# EAGLE design Felfil_PCB_0.9 (EAGLE 7.5.0)
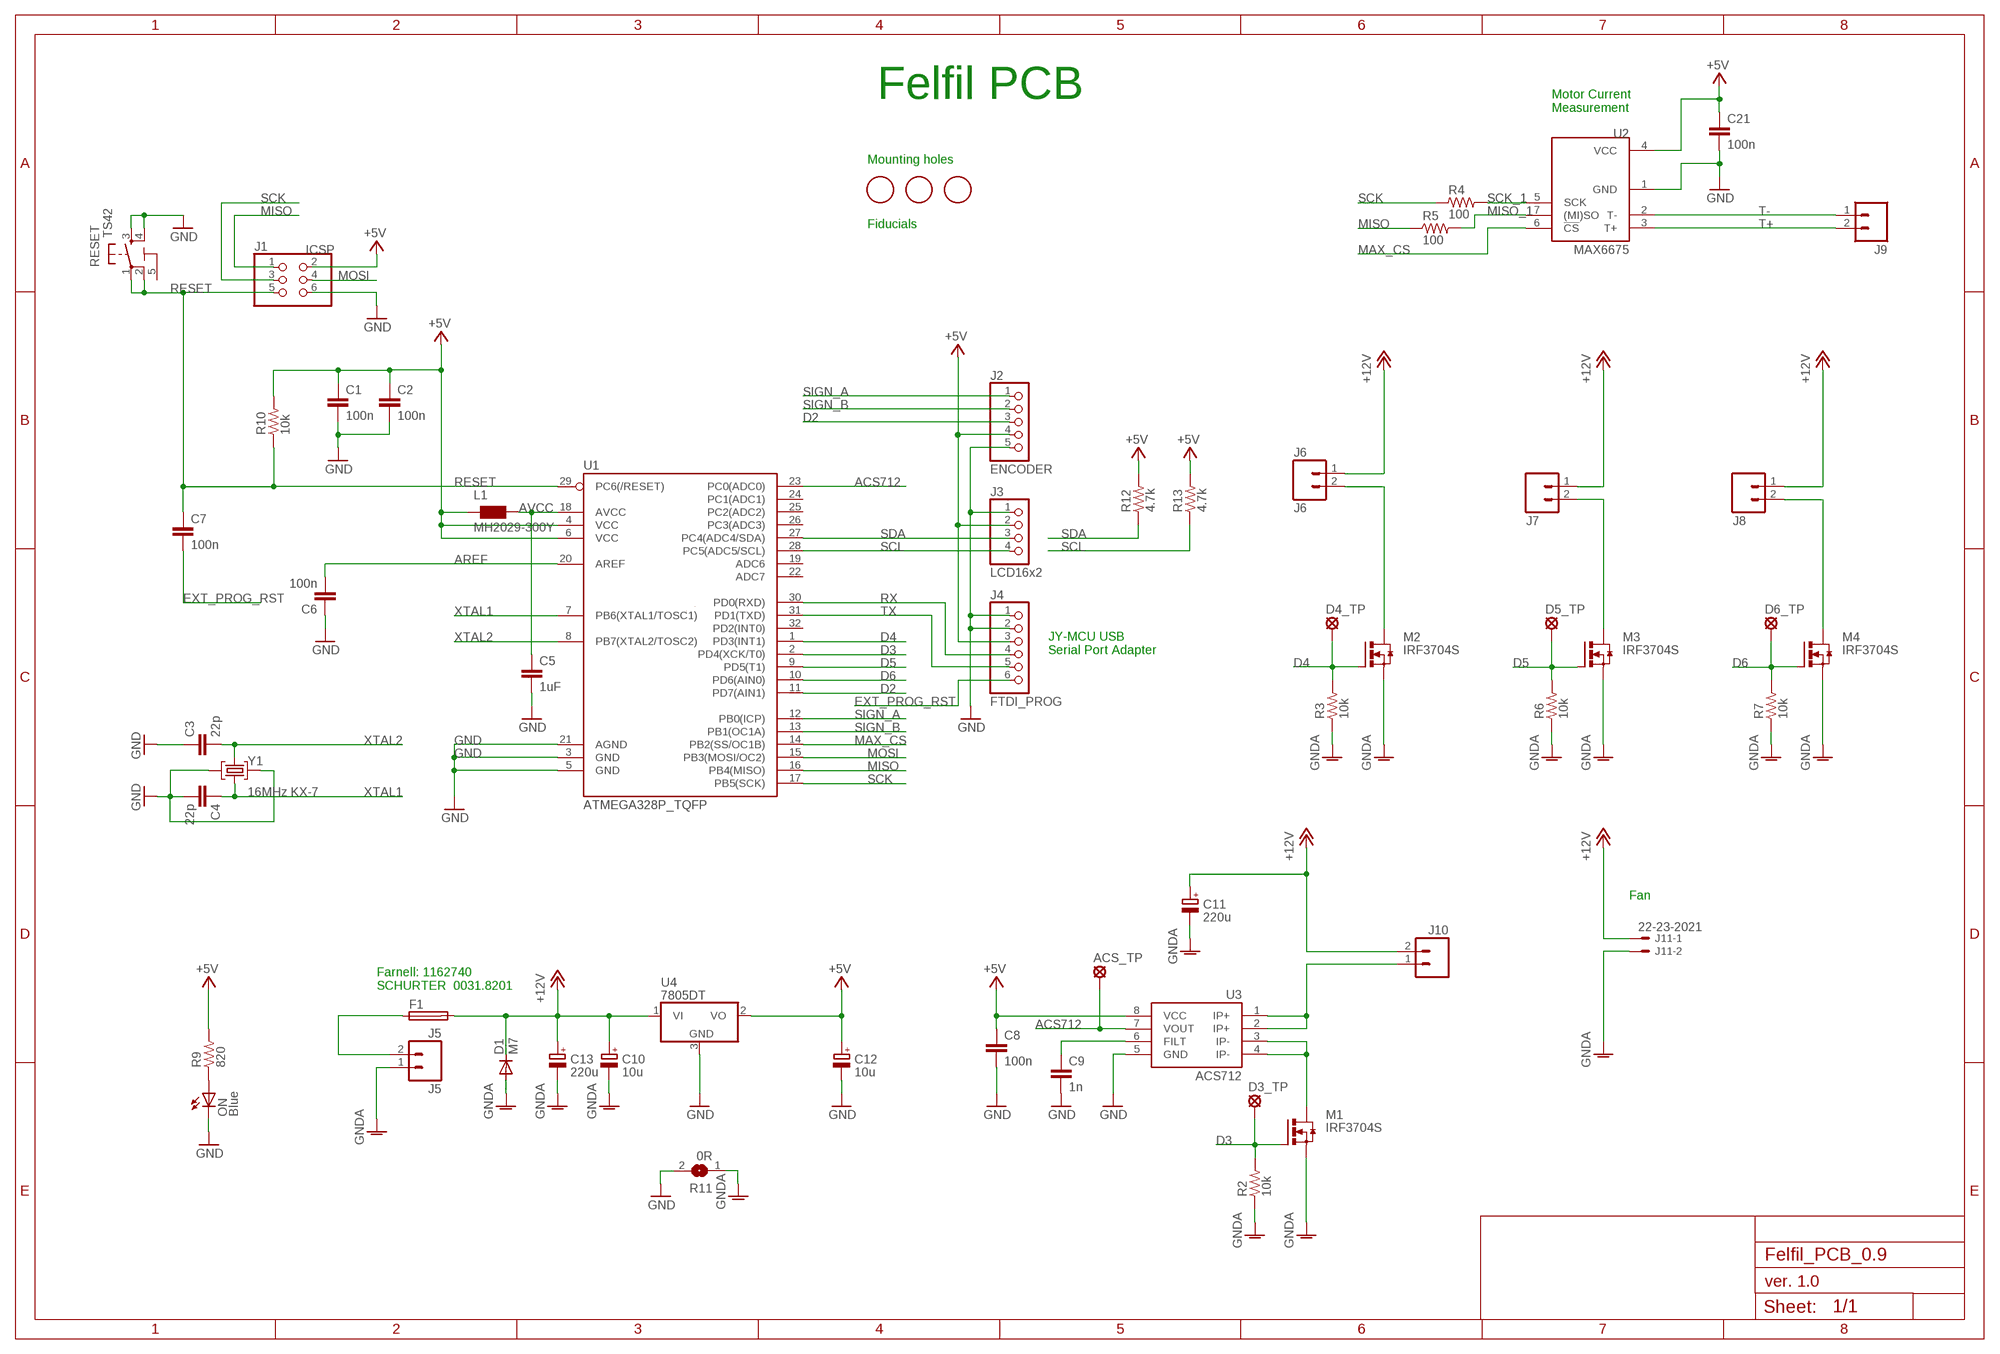
[diagram p0: schematic, sheet 1]

## Parts
ACS_TP  LSP11  [LSP11]
C1  100n  C-EUC0603K  [C0603K]
C2  100n  C-EUC0603K  [C0603K]
C3  22p  C-EUC0603K  [C0603K]
C4  22p  C-EUC0603K  [C0603K]
C5  1uF  C-EUC0603K  [C0603K]
C6  100n  C-EUC0603K  [C0603K]
C7  100n  C-EUC0603K  [C0603K]
C8  100n  C-EUC0603K  [C0603K]
C9  1n  C-EUC0603K  [C0603K]
C10  10u  CPOL-EUSMCB  [SMC_B]
C11  220u  CPOL-EUF  [PANASONIC_F]
C12  10u  CPOL-EUSMCB  [SMC_B]
C13  220u  CPOL-EUF  [PANASONIC_F]
C21  100n  C-EUC0603K  [C0603K]
D1  M7  DIODE-SMB  [SMB]
D3_TP  LSP11  [LSP11]
D4_TP  LSP11  [LSP11]
D5_TP  LSP11  [LSP11]
D6_TP  LSP11  [LSP11]
F1  FUSEBLANK_5X20MM  [FUSE_HOLDER_5X20MM]
FID1  FIDUCIALMOUNT  [FIDUCIA-MOUNT]
FID2  FIDUCIALMOUNT  [FIDUCIA-MOUNT]
FID3  FIDUCIALMOUNT  [FIDUCIA-MOUNT]
J1  ICSP  PINHD-2X3  [2X03]
J2  ENCODER  PINHD-1X5_2.54  [1X05]
J3  LCD16x2  PINHD-1X4_2.54  [1X04]
J4  FTDI_PROG  PINHD-1X6_2.54  [1X06]
J5  J5  M025MM  [SCREWTERMINAL-5MM-2]
J6  J6  M025MM  [SCREWTERMINAL-5MM-2]
J7  M025MM  [SCREWTERMINAL-5MM-2]
J8  M025MM  [SCREWTERMINAL-5MM-2]
J9  M025MM  [SCREWTERMINAL-5MM-2]
J10  M025MM  [SCREWTERMINAL-5MM-2]
J11  22-23-2021  [22-23-2021]
L1  MH2029-300Y  WE-CBF_0805  [0805]
M1  IRF3704S  [D2PACK]
M2  IRF3704S  [D2PACK]
M3  IRF3704S  [D2PACK]
M4  IRF3704S  [D2PACK]
ON  Blue  LEDCHIPLED_0805  [CHIPLED_0805]
R2  10k  R_0603  [R0603]
R3  10k  R_0603  [R0603]
R4  100  R_0603  [R0603]
R5  100  R_0603  [R0603]
R6  10k  R_0603  [R0603]
R7  10k  R_0603  [R0603]
R9  820  R_0603  [R0603]
R10  10k  R_0603  [R0603]
R11  0R  SJW  [SJW]
R12  4.7k  R_0603  [R0603]
R13  4.7k  R_0603  [R0603]
RESET  TS42  [TS42]
U1  ATMEGA328P_TQFP  [TQFP32-08]
U2  MAX6675  [SOIC8]
U3  ACS712  [SO08]
U4  7805DT  [TO252]
Y1  16MHz KX-7  CRYSTAL-3.2-2.5  [CRYSTAL-3.2-2.5]

## Nets
+5V [vcc]: C1.1 C2.1 C8.1 C12.+ C21.1 J1.2 J2.4 J3.2 J4.3 L1.1 R9.2 R10.2 R12.2 R13.2 U1.4(VCC) U1.6(VCC) U2.4(VCC) U3.8(VCC) U4.2(VO)
+12V [vcc]: C10.+ C11.+ C13.+ D1.C F1.2 J6.1 J7.1 J8.1 J10.2 J11.1 U4.1(VI)
ACS712: ACS_TP.MP U1.23(PC0(ADC0)) U3.7(VOUT)
AREF [vcc]: C6.2 U1.20(AREF)
AVCC [vcc]: C5.1 L1.2 U1.18(AVCC)
D2: J2.3 U1.11(PD7(AIN1))
D3: D3_TP.MP M1.1(G) R2.2 U1.2(PD4(XCK/T0))
D4: D4_TP.MP M2.1(G) R3.2 U1.1(PD3(INT1))
D5: D5_TP.MP M3.1(G) R6.2 U1.9(PD5(T1))
D6: D6_TP.MP M4.1(G) R7.2 U1.10(PD6(AIN0))
EXT_PROG_RST: C7.2 J4.6
GND [gnd]: C1.2 C2.2 C3.1 C4.2 C5.2 C6.1 C8.2 C9.2 C12.- C21.2 J1.6 J2.5 J3.1 J4.1 J4.2 ON.C R11.2 RESET.3 RESET.4 U1.3(GND) U1.5(GND) U1.21(AGND) U2.1(GND) U3.5(GND) U4.3(GND) Y1.2(GND) Y1.4(GND)
GNDA [gnd]: C10.- C11.- C13.- D1.A J5.1 J11.2 M1.3(S) M2.3(S) M3.3(S) M4.3(S) R2.1 R3.1 R6.1 R7.1 R11.1
MAX_CS: U1.14(PB2(SS/OC1B)) U2.6(!CS)
MISO: J1.1 R5.1 U1.16(PB4(MISO))
MISO_1: R5.2 U2.7((MI)SO)
MOSI: J1.4 U1.15(PB3(MOSI/OC2))
N$1: C9.1 U3.6(FILT)
N$3 [vcc]: M1.2(D) U3.3(IP-) U3.4(IP-)
N$4 [vcc]: F1.1 J5.2
N$5: ON.A R9.1
N$7 [vcc]: J10.1 U3.1(IP+) U3.2(IP+)
N$9 [vcc]: J6.2 M2.2(D)
N$10 [vcc]: J7.2 M3.2(D)
N$11 [vcc]: J8.2 M4.2(D)
RESET: C7.1 J1.5 R10.1 RESET.1 RESET.2 U1.29(PC6(/RESET))
RX: J4.4 U1.30(PD0(RXD))
SCK: J1.3 R4.1 U1.17(PB5(SCK))
SCK_1: R4.2 U2.5(SCK)
SCL: J3.4 R13.1 U1.28(PC5(ADC5/SCL))
SDA: J3.3 R12.1 U1.27(PC4(ADC4/SDA))
SIGN_A: J2.1 U1.12(PB0(ICP))
SIGN_B: J2.2 U1.13(PB1(OC1A))
T+: J9.2 U2.3(T+)
T-: J9.1 U2.2(T-)
TX: J4.5 U1.31(PD1(TXD))
XTAL1: C4.1 U1.7(PB6(XTAL1/TOSC1)) Y1.1(C1)
XTAL2: C3.2 U1.8(PB7(XTAL2/TOSC2)) Y1.3(C2)
Unconnected: U1.19(ADC6) U1.22(ADC7) U1.24(PC1(ADC1)) U1.25(PC2(ADC2)) U1.26(PC3(ADC3)) U1.32(PD2(INT0))

## Notes on the sheet
- Felfil PCB
- Motor Current
  Measurement
- Mounting holes
- Fiducials
- JY-MCU USB 
  Serial Port Adapter
- Fan
- Farnell: 1162740
  SCHURTER  0031.8201
- ver. 1.0

## Power pins joined to a net without a drawn wire
5-GND: RESET.5(5-GND)

## Library data of the parts
ACS_TP D3_TP D4_TP D5_TP D6_TP = solpad:LSP11: SOLDER PAD drill 1.1 mm
C1-C9 C21 = SmartPrj:C-EU: CAPACITOR, European symbol
C10-C13 = rcl:CPOL-EU: POLARIZED CAPACITOR, European symbol
D1 = diode:DIODE-: DIODE
F1 = fuse:FUSE: Fuse; OC_FARNELL: unknown; OC_NEWARK: unknown
FID1-FID3 = SmartPrj:FIDUCIALMOUNT
J1 = SmartPrj:PINHD-2X3: PIN HEADER
J2 = pinhead-1:PINHD-1X5: PIN HEADER
J3 = pinhead-1:PINHD-1X4: PIN HEADER
J4 = pinhead-1:PINHD-1X6: PIN HEADER
J5-J10 = SparkFun-Connectors:M02: Standard 2-pin 0.1" header. Use with - straight break away headers ( PRT-00116) - right angle break away headers (PRT-00553) - swiss pins (PRT-00743) - machine pins (PRT-00117) - female headers (PRT-00115) Molex polarized connector foot print use with: PRT-08233 with associated crimp pins and housings. 2.54_SCREWTERM for use with PRT-10571. 3.5mm Screw Terminal footprints for PRT-08084 5mm Screw Terminal footprints for use with PRT-08432; STOREFRONT_ID: PRT-08432
J11 = con-molex:22-23-2021: .100" (2.54mm) Center Header - 2 Pin; MF: MOLEX; MPN: 22-23-2021; OC_FARNELL: 1462926; OC_NEWARK: 25C3832
L1 = wuerth-elektronik:WE-CBF: SMD EMI Suppression Ferrite Beads - excellent anti-EMI properties - low DCR - impedances till 3000 ohms - rated current up to 6 A
M1-M4 = transistor-power1:IRF3704: SMPS MOSFET HEXFET® Power MOSFET Source: http://www.irf.com/product-info/datasheets/data/irf3704.pdf
ON = led:LED: LED OSRAM: - CHIPLED LG R971, LG N971, LY N971, LG Q971, LY Q971, LO R971, LY R971 LH N974, LH R974 LS Q976, LO Q976, LY Q976 LO Q996 - Hyper CHIPLED LW Q18S LB Q993, LB Q99A, LB R99A - SideLED LS A670, LO A670, LY A670, LG A670, LP A670 LB A673, LV A673, LT A673, LW A673 LH A674 LY A675 LS A676, LA A676, LO A676, LY A676, LW A676 LS A679, LY A679, LG A679 - Hyper Micro SIDELED® LS Y876, LA Y876, LO Y876, LY Y876 LT Y87S - SmartLED LW L88C, LW L88S LB L89C, LB L89S, LG L890 LS L89K, LO L89K, LY L89K LS L896, LA L896, LO L896, LY L896 - TOPLED LS T670, LO T670, LY T670, LG T670, LP T670 LSG T670, LSP T670, LSY T670, LOP T670, LYG T670 LG T671, LOG T671, LSG T671 LB T673, LV T673, LT T673, LW T673 LH T674 LS T676, LA T676, LO T676, LY T676, LB T676, LH T676, LSB T676, LW T676 LB T67C, LV T67C, LT T67C, LS T67K, LO T67K, LY T67K, LW E67C LS E67B, LA E67B, LO E67B, LY E67B, LB E67C, LV E67C, LT E67C LW T67C LS T679, LY T679, LG T679 LS T770, LO T770, LY T770, LG T770, LP T770 LB T773, LV T773, LT T773, LW T773 LH T774 LS E675, LA E675, LY E675, LS T675 LS T776, LA T776, LO T776, LY T776, LB T776 LHGB T686 LT T68C, LB T68C - Hyper Mini TOPLED® LB M676 - Mini TOPLED Santana® LG M470 LS M47K, LO M47K, LY M47K Source: http://www.osram.convergy.de LUXEON: - LUMILED® LXK2-PW12-R00, LXK2-PW12-S00, LXK2-PW14-U00, LXK2-PW14-V00 LXK2-PM12-R00, LXK2-PM12-S00, LXK2-PM14-U00 LXK2-PE12-Q00, LXK2-PE12-R00, LXK2-PE12-S00, LXK2-PE14-T00, LXK2-PE14-U00 LXK2-PB12-K00, LXK2-PB12-L00, LXK2-PB12-M00, LXK2-PB14-N00, LXK2-PB14-P00, LXK2-PB14-Q00 LXK2-PR12-L00, LXK2-PR12-M00, LXK2-PR14-Q00, LXK2-PR14-R00 LXK2-PD12-Q00, LXK2-PD12-R00, LXK2-PD12-S00 LXK2-PH12-R00, LXK2-PH12-S00 LXK2-PL12-P00, LXK2-PL12-Q00, LXK2-PL12-R00 Source: www.luxeon.com KINGBRIGHT: KA-3528ASYC Source: www.kingbright.com
R2-R7 R9 R10 R12 R13 = rc-master:R_: RESISTOR
R11 = jumper:SJ: SMD solder JUMPER
RESET = SmartPrj:TS42: TS42 Dongnan Electronics Tact switch VDC 12V - 50mA
U1 = SparkFun-DigitalIC:ATMEGA328P_TQFP; PROD_ID: IC-09069
U2 = SparkFun-AnalogIC:MAX6675: Cold-Junction-Compensated K-Thermocoupleto-Digital Converter (0°C to +1024°C) The MAX6675 performs cold-junction compensation and digitizes the signal from a type-K thermocouple. The data is output in a 12-bit resolution, SPI™-compatible, read-only format. This converter resolves temperatures to 0.25°C, allows readings as high as +1024°C, and exhibits thermocouple accuracy of 8LSBs for temperatures ranging from 0°C to +700°C.; PROD_ID: IC-12512
U3 = SparkFun-AnalogIC:ACS712: Hall-effect-based isolated linear current sensor; PROD_ID: IC-08964
U4 = linear:78*: Positive VOLTAGE REGULATOR Source: http://cache.national.com/ds/LM/LM78L05.pdf http://www.fairchildsemi.com/ds/LM/LM7805.pdf
Y1 = SmartPrj:CRYSTAL-3.2-2.5

## Net classes
0 default: width 0.254 mm, drill 0.61 mm, clearance 0.254 mm
1 power: width 0.762 mm, drill 1.524 mm, clearance 0.508 mm
2 gnd: width 0.254 mm, drill 0.61 mm, clearance 0.254 mm
3 vcc: width 0.254 mm, drill 0.61 mm, clearance 0.254 mm
4 gnd_power: width 0.762 mm, drill 1.524 mm, clearance 0.508 mm

## Board
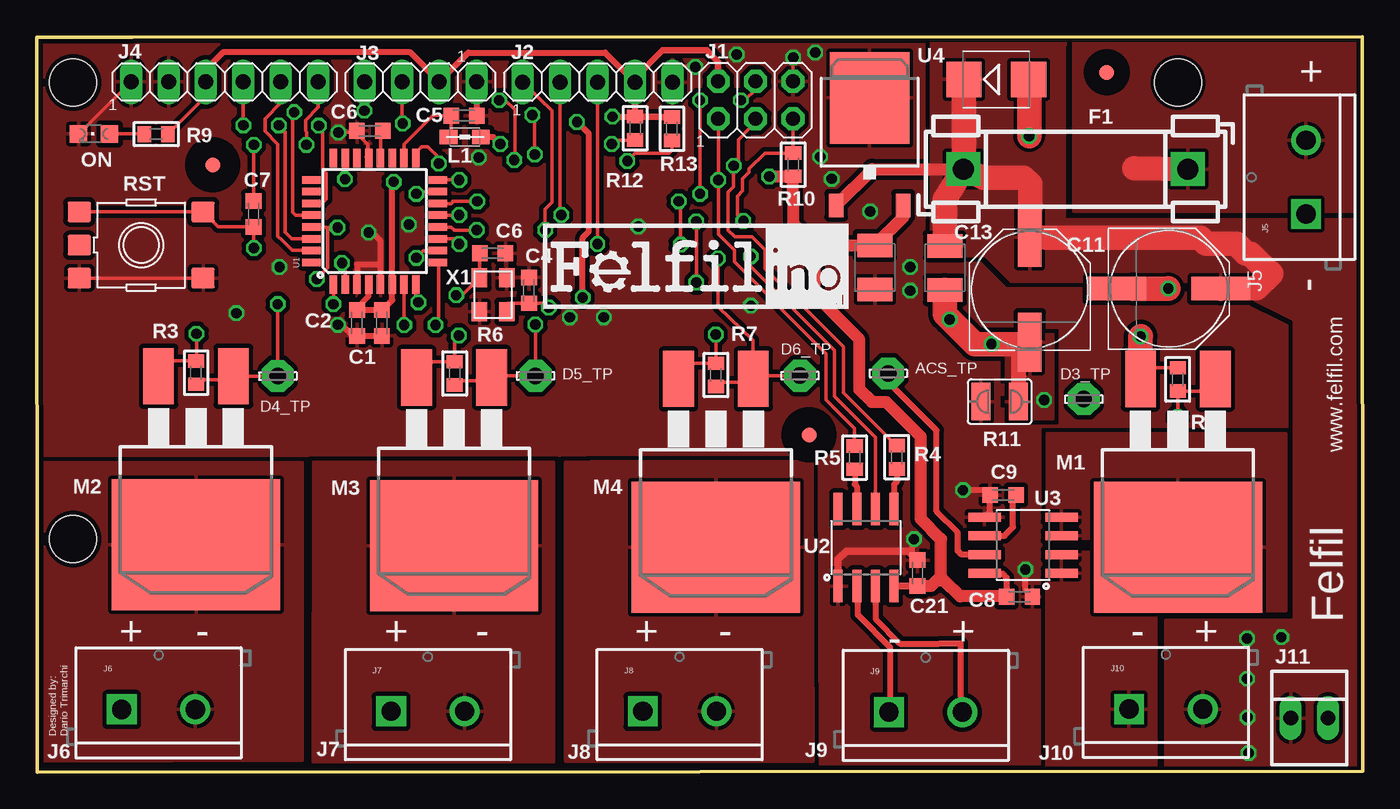
[diagram p1: board, top side]
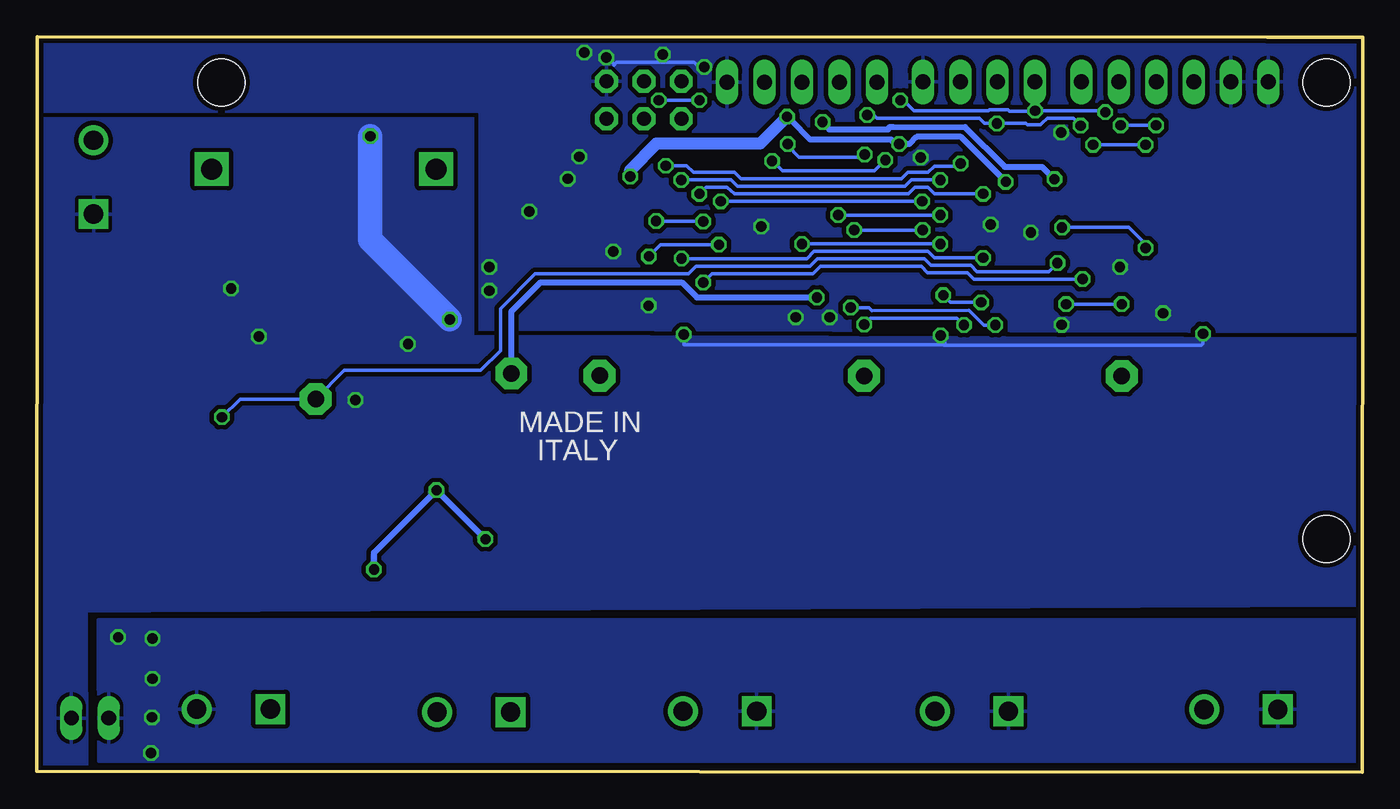
[diagram p2: board, bottom side, seen from below]

Size 90.03 x 49.91 mm. Coordinates in mm from the lower left corner, seen from the top.
Outline: 0,49.87 0.01,0 90.03,0.08 90.02,49.91 6.48,49.87 0,49.87
Copper layers (1*16): Top 0.035mm / dielectric 1.5mm / Bottom 0.035mm
Design rules "SeeedStudio_2layer_DRU_no_angle_20140221": minimum track width 6mil, minimum drill 12mil, track to track 6mil, track to pad 6mil, pad to pad 6mil, via to via 6mil, smd to smd 0mil, copper to edge 10mil, drill to drill 10mil, minimum pad ring 10mil, minimum via ring 6mil, stop-mask expansion 2mil, vias tented up to drill 100mil, thermal gap 10mil
Holes 3.2 mm at 2.46,46.81 77.5,46.81 2.46,15.82
vRestrict: area 45.3,17.2 to 45.8,17.5; area 38.5,13.8 to 39.2,14.3; area 47.2,13.8 to 47.9,14.3; area 44,13.8 to 44.5,14.3; area 50.6,-11.1 to 51.2,-10.6; area 53.1,-11.2 to 53.6,-10.4

### Footprints (pad centres in the part's own frame; a part is rotated, then mirrored left to right if it is on the bottom)
LSP11 = drill 1.118 pad 2.159 octagon: MP 0,0
C0603K = smd 1.05 x 1.08: 1 -0.875,0; 2 0.875,0
SMC_B = smd 1.6 x 2.4: + -1.5,0; - 1.5,0
PANASONIC_F = smd 4 x 1.6: + 3.55,0; - -3.55,0
SMB = smd 2.4 x 2.4: A 2.2,0; C -2.2,0
FUSE_HOLDER_5X20MM = drill 1.422 pad 2.286 square: 1 0,0; 2 15.24,0
FIDUCIA-MOUNT = smd 1.016 x 1.016: P$1 0,0
2X03 = drill 0.95 pad 1.55 octagon: 1 -2.54,-1.27; 2 -2.54,1.27; 3 0,-1.27; 4 0,1.27; 5 2.54,-1.27; 6 2.54,1.27
1X05 = drill 1.016 long: 1 -5.08,0; 2 -2.54,0; 3 0,0; 4 2.54,0; 5 5.08,0
1X04 = drill 1.016 long: 1 -3.81,0; 2 -1.27,0; 3 1.27,0; 4 3.81,0
1X06 = drill 1.016 long: 1 -6.35,0; 2 -3.81,0; 3 -1.27,0; 4 1.27,0; 5 3.81,0; 6 6.35,0
SCREWTERMINAL-5MM-2 = drill 1.3 pad 2.032 square: 1 0,0 | drill 1.3 pad 2.032: 2 5,0
22-23-2021 = drill 1 long: 1 -1.27,0; 2 1.27,0
0805 = smd 1.2 x 1: 1 -1.1,0; 2 1.1,0
D2PACK = smd 2.083 x 3.81: 1 -2.54,-8.89; 3 2.54,-8.89 | smd 11.43 x 8.89: 2 0,2.54
CHIPLED_0805 = smd 1.2 x 1.2: A 0,-1.05; C 0,1.05
R0603 = smd 0.9 x 1.1: 1 -0.794,0; 2 0.794,0
SJW = smd 1.27 x 2.54: 1 -1.27,0; 2 1.27,0
TS42 = smd 1.6 x 1.4: 1 -4.2,2.25; 2 4.2,2.25; 3 -4.2,-2.25; 4 4.2,-2.25; 5 -4.2,0
TQFP32-08 = smd 1.27 x 0.508: 1 -4.293,2.8; 2 -4.293,2; 3 -4.293,1.2; 4 -4.293,0.4; 5 -4.293,-0.4; 6 -4.293,-1.2; 7 -4.293,-2; 8 -4.293,-2.8; 17 4.293,-2.8; 18 4.293,-2; 19 4.293,-1.2; 20 4.293,-0.4; 21 4.293,0.4; 22 4.293,1.2; 23 4.293,2; 24 4.293,2.8 | smd 0.508 x 1.27: 9 -2.8,-4.293; 10 -2,-4.293; 11 -1.2,-4.293; 12 -0.4,-4.293; 13 0.4,-4.293; 14 1.2,-4.293; 15 2,-4.293; 16 2.8,-4.293; 25 2.8,4.293; 26 2,4.293; 27 1.2,4.293; 28 0.4,4.293; 29 -0.4,4.293; 30 -1.2,4.293; 31 -2,4.293; 32 -2.8,4.293
SOIC8 = smd 0.61 x 2.21: 1 -1.905,-2.616; 2 -0.635,-2.616; 3 0.635,-2.616; 4 1.905,-2.616; 5 1.905,2.616; 6 0.635,2.616; 7 -0.635,2.616; 8 -1.905,2.616
SO08 = smd 0.61 x 2.21: 1 -1.905,-2.616; 2 -0.635,-2.616; 3 0.635,-2.616; 4 1.905,-2.616; 5 1.905,2.616; 6 0.635,2.616; 7 -0.635,2.616; 8 -1.905,2.616
TO252 = smd 1 x 1.6: 1 -2.28,-4.8; 2 2.28,-4.8 | smd 5.4 x 6.2: 3 0,2.5
CRYSTAL-3.2-2.5 = smd 1.3 x 1.05: 1 -1.15,-0.925; 2 1.15,-0.925; 3 1.15,0.925; 4 -1.15,0.925

### Placement (x,y rotation side)
ACS_TP  57.81,27.06 0 top
C1  23.43,30.49 270 top
C2  21.74,30.48 270 top
C3  30.95,35.22 180 top
C4  33.41,32.7 90 top
C5  29.01,44.56 0 top
C6  22.62,43.52 0 top
C7  14.72,37.88 90 top
C8  66.73,11.9 0 top
C9  65.61,18.81 180 top
C10  61.66,34.23 270 top
C11  76.86,32.82 0 top
C12  56.91,34.25 270 top
C13  67.42,32.74 90 top
C21  59.79,13.51 90 top
D1  65.15,47.02 0 top
D3_TP  71.09,25.32 0 top
D4_TP  16.36,26.89 0 top
D5_TP  33.86,26.9 0 top
D6_TP  51.82,26.91 0 top
F1  78.16,40.93 180 top
FID1  72.66,47.5 0 top
FID2  11.95,41.22 0 top
FID3  52.44,22.9 0 top
J1  48.81,45.62 0 top
J2  38.07,46.84 0 top
J3  26.06,46.85 180 top
J4  12.75,46.85 0 top
J5  86.18,37.88 90 top
J6  5.77,4.25 0 top
J7  24.05,4.13 0 top
J8  41.15,4.13 0 top
J9  57.86,4.08 0 top
J10  74.17,4.28 0 top
J11  86.41,3.67 0 top
L1  29.06,43.1 180 top
M1  77.48,17.79 180 top
M2  10.81,17.98 180 top
M3  28.33,17.89 180 top
M4  46.11,17.81 180 top
ON  3.89,43.32 90 top
R2  77.47,26.66 270 top
R3  10.82,27.11 270 top
R4  58.39,21.37 270 top
R5  55.54,21.35 270 top
R6  28.37,27.06 270 top
R7  46.11,26.96 270 top
R9  8.1,43.31 0 top
R10  51.36,41.24 270 top
R11  65.38,25.15 180 top
R12  40.63,43.7 90 top
R13  43.13,43.68 90 top
RESET  7.09,35.78 0 top
U1  22.94,37.4 90 top
U2  56.31,15.24 0 top
U3  66.97,15.41 90 top
U4  56.55,43.27 0 top
Y1  30.99,32.41 90 top

### Tracks (layer width: path | path; a pad name or v marks a point on that pad's centre or on a via)
+5V  (via drill 0.7 pad 0.61)
  Top 0.254: 40.61,44.51 R12.2 40.74,44.49 | 42.42,44.46 42.39,44.49 | R13.2 | R9.2 11.48,45.89 J4.3
  Top 0.406: U1.4 22.53,32.32 21.74,31.53 C2.1 21.75,31.37 C1.1 23.46,31.37 24.13,32.04 U1.6 24.14,39.97 v24.23,40.07 | L1.1 30.17,43.12 30.99,43.12 v31.47,42.63 | v39.09,44.49 R12.2 | 11.48,45.89 11.48,47.69 12.67,48.88 25.3,48.88 J3.2 27.33,46.88 29.29,48.83 38.59,48.83 J2.4 | U3.8 64.38,13.47 65.58,13.47 65.85,13.21 C8.1
  Top 0.457: 40.61,44.51 J2.4 40.61,47.1 42.49,48.98 45.52,48.98 46.27,48.23 J1.2 | 42.39,44.49 40.74,44.49 | R13.2 42.42,44.46
  Top 0.508: U2.4 C21.1
  Top 0.813: 52.83,35.75 51.38,37.2 51.36,40.4 | 51.36,40.4 R10.2 | 51.36,40.4 49.83,40.42 v49.73,40.42 | U4.2 58.84,37.66 C12.+ 53.95,35.75 53.31,35.75 52.83,35.75 | C21.1 60.73,12.64 61.1,13 | 61.1,13 61.39,13.3 61.39,15.81 60.02,17.18 60.02,22.77 57.66,25.13 56.69,25.13 55.85,25.97 55.85,29.38 52.83,32.4 52.83,35.75 | C8.1 65.83,11.93 62.69,11.93 61.61,13 61.1,13
  Bottom 0.406: v39.09,44.49 38.79,44.21 37.52,42.94 32.03,42.94 31.72,42.63 v31.47,42.63 30.78,42.63 30.3,43.12 27.28,43.12 v24.23,40.07
  Bottom 0.813: v49.73,40.42 49.73,40.86 47.95,42.68 40.89,42.68 v39.09,44.49
+12V  (via drill 0.7 pad 0.61)
  Top 0.813: U4.1 56.74,40.93 F1.2
  Top 1.676: F1.2 62.95,41.68 D1.C | F1.2 61.66,38.89 C10.+ | F1.2 64.29,40.35 66.98,40.35 67.45,39.9 C13.+ 68.56,36.28 79.02,36.26 79.4,35.88 81.43,35.88 82.12,35.19 82.4,35.19 82.98,34.61 83.82,33.85 82.82,32.84 C11.+
  other vias: 84.51,9.16 82.17,6.34 82.17,9.08 82.22,3.72 82.27,1.31
  pour Bottom (isolate 0.305): 85.83,0.72 0.2,0.72 0.15,0.67 0.13,10.38 85.85,10.35
  pour Top: 76.66,-0.04 76.66,10.33 85.37,10.33 85.37,30.72 81.89,32.45 80.04,32.91 79.63,33.31 66.14,33.31 64.41,35.04 60.76,35.04 60.76,49.95 69.85,49.97 69.85,49.36 69.77,49.29 69.77,37.53 89.64,37.5 89.66,-0.04
ACS712  (via drill 0.7 pad 0.61)
  Top 0.406: v20.93,40.25 U1.23 | v36.68,44.13 37.49,43.32 37.49,36.72 37.06,36.28 v37.06,32.22 | U3.7 62.79,14.77 62.53,15.02 62.53,16.27 61.09,17.72 61.09,23.2 57.81,26.48 ACS_TP.MP
  Bottom 0.406: v20.93,40.25 21.77,41.08 24.31,41.08 27,43.78 31.88,43.8 32.11,43.8 32.23,43.62 36.22,43.62 v36.68,44.13 | v37.06,32.22 45.21,32.22 46.23,33.24 55.83,33.24 57.81,31.25 ACS_TP.MP
AREF
  Top 0.254: C6.2 23.34,43.29 U1.20
AVCC
  Top 0.254: U1.18 24.94,42.61 26.92,44.59 C5.1 28.13,43.28 L1.2
D2  (via drill 0.7 pad 0.61)
  Top 0.254: v38.07,35.85 J2.3 | v28.68,35.85 28.32,36.21 U1.11
  Bottom 0.254: v28.68,35.85 v38.07,35.85
D3  (via drill 0.7 pad 0.61)
  Top 0.254: v20.73,34.56 20.93,34.35 U1.2 | 79.75,27.91 80.06,27.6 80.06,26.72 M1.1 80.02,25.84 80.09,25.84 80.09,25.86 R2.2 v77.47,24.09
  Bottom 0.254: v20.73,34.56 21.31,33.97 26.19,33.97 26.62,34.4 29.31,34.4 29.74,34.84 37.03,34.84 37.54,34.33 45.26,34.33 45.77,33.82 56.18,33.82 58.55,31.46 58.55,28.61 59.89,27.27 69.15,27.27 D3_TP.MP 76.24,25.32 v77.47,24.09
D4  (via drill 0.7 pad 0.61)
  Top 0.254: R3.2 10.85,26.3 11.16,26.62 13.09,26.62 M2.1 13.36,26.89 D4_TP.MP v16.36,31.76 | v20.14,31.76 U1.1
  Bottom 0.254: v20.14,31.76 v16.36,31.76
D5  (via drill 0.7 pad 0.61)
  Top 0.254: R6.2 28.68,26.56 30.15,26.56 30.38,26.78 M3.1 30.99,26.9 D5_TP.MP v33.86,30.39 | v27.08,30.34 27.28,30.54 27.28,34.61 U1.9
  Bottom 0.254: v33.86,30.39 33.43,30.82 27.56,30.82 v27.08,30.34
D6  (via drill 0.7 pad 0.61)
  Top 0.254: 48.62,26.7 M4.1 48.87,26.91 D6_TP.MP | 48.62,26.7 48.42,26.7 48.18,26.45 46.62,26.47 R7.2 | v46.25,34.86 46.25,31.58 48.62,29.32 48.62,26.7 | v25.78,34.91 26.14,35.27 26.14,35.29 26.24,35.39 U1.10
  Bottom 0.254: v46.25,34.86 37.74,34.86 37.26,35.34 29.51,35.34 29.08,34.91 v25.78,34.91
EXT_PROG_RST  (via drill 0.7 pad 0.61)
  Top 0.254: v14.73,42.58 14.73,38.75 C7.2 | v18.31,42.58 18.31,43.42 18.24,43.52 18.24,44.26 19.1,45.12 J4.6
  Bottom 0.254: v18.31,42.58 v14.73,42.58
GND  (via drill 0.7 pad 0.61)
  Top 0.254: v20.47,43.42 21.54,43.42 C6.1 21.64,43.47 22.45,42.61 22.45,41.77 | U1.21 22.5,41.72 | 29.86,46.85 J3.1 | v51.36,48.5 51.36,46.9 J1.6 | J2.5 43.15,47.56 43.59,47.99 v44.7,47.87 | J4.1 2.87,43.32 ON.C | RESET.3 RESET.4
  Top 0.406: U1.21 | 22.5,41.72 22.45,41.77 | C5.2 29.86,46.85 | C2.2 23.42,29.61 C1.2 23.42,29.6 21.46,29.6 20.7,30.37 v20.45,30.37 | U1.5 23.34,34.45 23.34,34.46 | 23.34,34.46 21.74,34.46 U1.3 | 23.34,34.46 23.34,36.06 22.76,36.64 v22.53,36.64 | U3.5 64.73,17.69 C9.2 64.4,19.14 v62.89,19.14 | v59.56,15.81 59.44,15.68 59.44,14.74 | C8.2 67.13,12.37 v67.13,13.75
  Top 0.508: U2.1 54.41,14.44 54.97,15 59.18,15 59.44,14.74 C21.2
  Bottom 0.254: v20.47,43.42 20.01,43.42 | v51.36,48.5 50.9,48.12 50.85,48.07 50.85,47.99 50.67,48.17 45.41,48.17 45.11,47.87 v44.7,47.87
  Bottom 0.406: v20.45,30.37 20.42,30.37 | v22.53,36.64 22.5,36.64 | v59.56,15.81 v62.89,19.14 67.13,14.9 v67.13,13.75
  other vias: 59.31,34.28 25.27,37.17 30.02,41.72 16.48,34.28 13.56,31.15 36.2,30.87 38.51,30.87 40.84,37.05 48.49,31.66 53.97,40.27 50.88,35.34 47.52,48.7 59.31,32.68 56.59,38.06 52.86,48.86 53.19,41.77
  pour Top (isolate 0.305, rank 2): -0.74,50.89 89.79,50.63 89.76,-0.75 -0.74,-0.8 -1.45,-0.19 -1.3,50.43
  pour Bottom (isolate 0.305, rank 2): -0.74,50.56 89.76,50.3 89.36,-0.6 -0.89,-0.55 -1.17,-0.27 -1.02,50.36
GNDA  (via drill 0.7, 0.7 pad 0.61)
  Top 0.254: M2.3 9.3,27.91 R3.1 10.85,27.93 v10.85,29.76 | M3.3 26.87,27.86 R6.1 28.37,29.35 v28.65,29.63 | M4.3 44.63,27.76 R7.1 46.11,29.69 v46.1,29.71 | 75.13,26.68 M1.3 | R2.1 74.96,27.45 74.94,27.47
  Top 1.016: R11.1 66.67,25.17 66.67,29.04
  Top 1.422: C11.- 74.41,32.82
  Top 1.676: C13.- 66.67,29.04 63.68,29.04 v61.99,30.73 61.66,31.06 C10.- | D1.A 67.39,46.98 v67.39,43.17 | M1.3 74.94,27.47 74.94,29.57 v74.96,29.58 | 74.41,32.82 76.82,32.82 v76.83,32.83
  Bottom 0.254: 28.42,29.15 28.37,29.15 v28.65,29.63 28.42,28.97 10.95,28.97 10.85,29.07 v10.85,29.76 | 28.42,29.15 28.45,29.15 28.57,29.02 41,29.02 46.08,28.99 46.1,29.25 v46.1,29.71 | 28.42,29.15 28.4,29.17
  Bottom 1.676: v67.39,43.17 67.39,36.13 v61.99,30.73
  other vias: 64.82,29.07 68.4,25.26
  pour Bottom (isolate 0.305): 0.13,11.34 0.13,29.43 60.43,29.6 60.43,44.39 89.81,44.36 89.81,29.43 89.74,-0.09 86.64,-0.04 86.69,10.93 82.32,10.96 0.2,11.34
  pour Top: 65.84,29.68 65.84,23.94 68.99,23.99 68.99,29.73
MAX_CS  (via drill 0.7 pad 0.61)
  Top 0.254: v43.59,38.75 43.69,38.62 43.71,38.6 v43.71,35.8 | v29.92,38.75 28.22,38.75 28.22,38.7 28.12,38.6 U1.14 | v48.46,35.01 48.46,34.35 54.18,28.64 54.18,25.51 55.83,23.84 56.44,23.23 56.95,22.75 U2.6
  Bottom 0.254: v29.92,38.75 v43.59,38.75 | v43.71,35.8 47.68,35.8 v48.46,35.01
MISO  (via drill 0.7 pad 0.61)
  Top 0.254: v28.68,40.2 U1.16 | J1.1 46.28,44.34 v46.28,40.2 46.28,36.51 47.37,35.42 47.37,34.63 53.59,28.41 53.59,25.26 55.52,23.33 55.52,22.16 R5.1
  Bottom 0.254: v28.68,40.2 30.66,40.2 31.09,39.76 42.47,39.76 42.9,40.2 v46.28,40.2
MISO_1
  Top 0.406: R5.2 55.54,19.53 55.68,19.39 U2.7
MOSI  (via drill 0.7 pad 0.61)
  Top 0.254: v47.8,45.61 48.06,45.61 48.82,46.37 48.82,46.88 J1.4 | v45.03,39.26 v45.03,45.61 | v25.78,39.26 25.93,39.41 U1.15
  Bottom 0.254: v45.03,45.61 v47.8,45.61 | v45.03,39.26 44.6,39.69 43.15,39.69 42.67,39.26 30.84,39.26 30.4,39.69 29.51,39.69 29.08,39.26 v25.78,39.26
N$1
  Top 0.406: U3.6 65.71,16.04 66.29,16.62 66.29,18.62 C9.1
N$3
  pour Top: 68.61,15.86 68.61,23 84.81,22.97 84.81,10.96 77.39,10.96 77.39,15.84
N$4
  Top 1.676: 74.51,40.97 F1.1
  pour Top: 89.56,49.95 70.41,49.95 70.41,38.09 89.56,38.09
N$5
  Top 0.254: R9.1 7.3,43.32 ON.A
N$7
  pour Top: 68.58,14.95 68.58,-0.09 76,-0.11 76,14.92
N$9
  pour Top (isolate 0.305): 2.49,20.99 18.01,21.02 18.01,0.8 0.38,0.72 0.41,20.99
N$10
  pour Top (isolate 0.305): 18.8,21.02 35.1,21.02 35.1,0.67 18.77,0.7
N$11
  pour Top (isolate 0.305): 37.62,21.07 52.63,21.07 52.7,0.72 35.89,0.72 35.92,21.04
RESET  (via drill 0.7 pad 0.61)
  Top 0.254: 14.73,37.05 14.73,37.02 | v14.73,35.57 14.73,37.02 | 19.75,36.9 19.74,36.36 19.74,36.92 19.63,37 U1.29 | 14.73,37.02 C7.1 12.3,37.01 RESET.2 RESET.1 | v44.78,33.24 v44.78,37.38 | v19.02,33.46 19.41,33.85 19.41,33.9 19.74,34.23 19.74,36.18 19.75,36.9 | J1.5 51.36,44.34 R10.1 51.16,42.02 49.43,42.02 48.36,40.96 48.36,40.7 47.93,40.27 47.93,39.46 47.57,39.1 47.57,37.81 v47.98,37.4 | 19.75,36.9 19.82,36.97 v20.42,36.97
  Bottom 0.254: v20.42,36.97 15.87,36.97 14.73,35.83 v14.73,35.57 | v44.78,33.24 44.2,33.82 37.31,33.82 36.8,34.33 29.97,34.33 29.54,33.9 26.85,33.9 26.42,33.46 v19.02,33.46 | v44.78,37.38 47.95,37.38 v47.98,37.4
RX  (via drill 0.7 pad 0.61)
  Top 0.254: v16.43,43.9 16.87,43.47 16.87,36.64 17.3,36.21 U1.30 | J4.4 v14.02,43.9
  Bottom 0.254: v14.02,43.9 v16.43,43.9
SCK  (via drill 0.7 pad 0.61)
  Top 0.254: 27.3,41.41 v27.3,41.31 27.3,41.69 26.54,42.46 26.14,42.46 25.74,42.06 U1.17 | J1.3 48.82,44.34 48.82,43.73 48.44,43.73 47.65,42.94 47.65,41.49 v47.32,41.16 47.32,39.74 46.94,39.36 46.94,36.79 47.4,36.33 48.56,36.33 49.45,35.45 49.45,34.18 54.76,28.87 54.76,25.74 58.36,22.17 R4.1
  Bottom 0.254: v27.3,41.31 27.48,41.14 29.08,41.14 29.51,40.7 30.89,40.7 31.32,40.27 42.21,40.27 42.65,40.7 45.44,40.7 45.9,41.16 v47.32,41.16
SCK_1
  Top 0.406: R4.2 58.39,19.7 58.22,19.52 U2.5
SCL  (via drill 0.7 pad 0.61)
  Top 0.254: U1.28 17.58,37.81 17.37,38.01 17.37,44.69 v17.47,44.79 | J3.4 v22.25,44.89 | v31.39,45.61 31.8,45.61 32.46,44.95 32.46,41.59 v32.41,41.54 | v40.11,41.49 40.61,42.02 42.93,42.02 43.13,42.23 43.13,42.86 43.15,42.86 R13.1
  Bottom 0.254: v17.47,44.79 17.6,44.89 v22.25,44.89 22.28,44.87 24,44.87 24.1,44.95 25.35,44.95 25.43,44.89 30.48,44.89 31.19,45.61 v31.39,45.61 | v32.41,41.54 33.15,40.81 39.4,40.81 v40.11,41.49
SDA  (via drill 0.7 pad 0.61)
  Top 0.254: v19.15,43.88 19.41,43.65 19.41,40.91 19.66,40.65 19.66,38.9 19.35,38.6 U1.27 | J3.3 24.79,44.11 v24.84,44.03 | v33.65,44.62 33.81,44.46 v33.81,41.92 | v39.04,42.63 39.31,42.91 R12.1
  Bottom 0.254: v19.15,43.88 19.63,44.39 21.41,44.39 21.79,44.03 21.89,43.93 22.78,43.93 22.89,44.03 v24.84,44.03 25.68,44.03 26.03,44.39 32.97,44.39 33.22,44.62 v33.65,44.62 | v33.81,41.92 33.98,41.74 38.28,41.74 39.04,42.51 v39.04,42.63
SIGN_A  (via drill 0.7 pad 0.61)
  Top 0.254: v29.87,36.79 28.32,36.79 28.32,36.82 28.14,37 U1.12 | J2.1 34.11,45.76 34.98,44.89 34.98,38.67 34.52,38.21 v34.52,36.79
  Bottom 0.254: v29.87,36.79 v34.52,36.79
SIGN_B  (via drill 0.7 pad 0.61)
  Top 0.254: v28.68,37.81 U1.13 | v35.61,37.81 35.53,37.88 J2.2
  Bottom 0.254: v28.68,37.81 v35.61,37.81
T+
  Top 0.254: 62.73,8.76 62.73,8.72
  Top 0.406: U2.3 56.95,10.4 58.62,8.72 61.3,8.72 62.73,8.72 62.73,4.32 J9.2
T-
  Top 0.254: 55.74,12.57 U2.2 | 57.96,4.32 J9.1
  Top 0.406: U2.2 55.59,12.62 | 55.74,12.57 55.74,10.67 57.96,8.45 57.96,4.32
TX
  Top 0.254: U1.31 18.62,35.42 17.35,35.42 16.56,36.21 16.46,36.28 16.36,36.39 16.36,42.63 15.49,43.5 15.49,44.36 16.56,45.43 J4.5
XTAL1  (via drill 0.7 pad 0.61)
  Top 0.254: Y1.1 31.9,31.28 31.9,31.79 31.95,31.84 33.4,31.84 C4.1 33.53,31.84 34.47,31.84 v34.77,31.53 | v24.94,30.34 U1.7
  Bottom 0.254: v24.94,30.34 25.73,30.34 26.75,31.36 33.32,31.33 33.53,31.53 v34.77,31.53
XTAL2  (via drill 0.7 pad 0.61)
  Top 0.254: C3.2 Y1.3 28.87,32.37 v28.47,32.37 | U1.8 25.74,32.07 v25.91,31.89
  Bottom 0.254: v25.91,31.89 27.99,31.89 v28.47,32.37

### Text on the board
tNames: 1 | + | 1 | C6 | 1 | C5 | 1 | L1 | RST | C6 | C4 | X1 | J5 | - | C2 | C1 | www.felfil.com | + | - | + | - | + | - | - | + | - | + | Felfil | Designed by: / Dario Trimarchi | J9 | J10 | J6 | J7 | J8
bNames: MADE IN | ITALY
ReferenceLC: X2